# Altium schematic sheet Semikron_BrakeChopper.SchDoc
size A; SheetNumber: 2; SheetTotal: 6
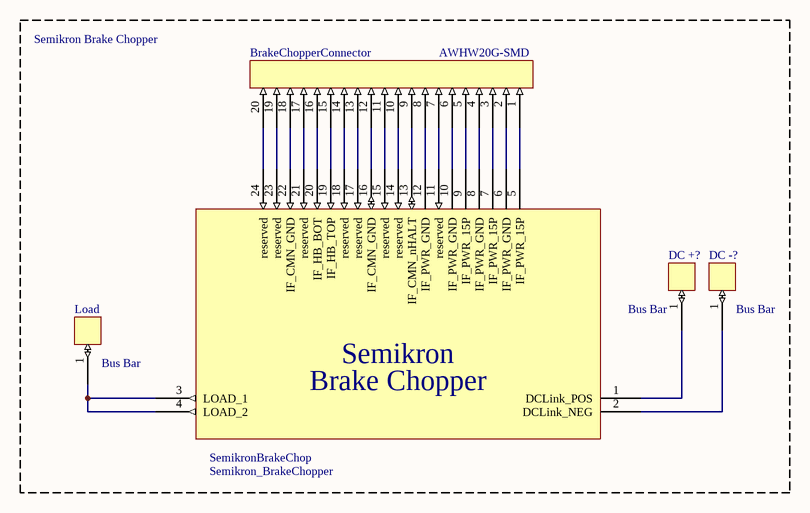
[diagram p0: Semikron_BrakeChopper.SchDoc]

## Parts
BrakeChopperConnector  AWHW20G-SMD
DC_+?  Bus Bar
DC_-?  Bus Bar
Load  Bus Bar
SemikronBrakeChop  Semikron_BrakeChopper

## Blocks framed on the sheet
Semikron Brake Chopper: BrakeChopperConnector DC_+? DC_-? Load SemikronBrakeChop

## Nets
NetBrakeChopperConnector_1: BrakeChopperConnector.1 SemikronBrakeChop.5(IF_PWR_15P)
NetBrakeChopperConnector_2: BrakeChopperConnector.2 SemikronBrakeChop.6(IF_PWR_GND)
NetBrakeChopperConnector_3: BrakeChopperConnector.3 SemikronBrakeChop.7(IF_PWR_15P)
NetBrakeChopperConnector_4: BrakeChopperConnector.4 SemikronBrakeChop.8(IF_PWR_GND)
NetBrakeChopperConnector_5: BrakeChopperConnector.5 SemikronBrakeChop.9(IF_PWR_15P)
NetBrakeChopperConnector_6: BrakeChopperConnector.6 SemikronBrakeChop.10(IF_PWR_GND)
NetBrakeChopperConnector_7: BrakeChopperConnector.7 SemikronBrakeChop.11(reserved)
NetBrakeChopperConnector_8: BrakeChopperConnector.8 SemikronBrakeChop.12(IF_PWR_GND)
NetBrakeChopperConnector_9: BrakeChopperConnector.9 SemikronBrakeChop.13(IF_CMN_nHALT)
NetBrakeChopperConnector_10: BrakeChopperConnector.10 SemikronBrakeChop.14(reserved)
NetBrakeChopperConnector_11: BrakeChopperConnector.11 SemikronBrakeChop.15(reserved)
NetBrakeChopperConnector_12: BrakeChopperConnector.12 SemikronBrakeChop.16(IF_CMN_GND)
NetBrakeChopperConnector_13: BrakeChopperConnector.13 SemikronBrakeChop.17(reserved)
NetBrakeChopperConnector_14: BrakeChopperConnector.14 SemikronBrakeChop.18(reserved)
NetBrakeChopperConnector_15: BrakeChopperConnector.15 SemikronBrakeChop.19(IF_HB_TOP)
NetBrakeChopperConnector_16: BrakeChopperConnector.16 SemikronBrakeChop.20(IF_HB_BOT)
NetBrakeChopperConnector_17: BrakeChopperConnector.17 SemikronBrakeChop.21(reserved)
NetBrakeChopperConnector_18: BrakeChopperConnector.18 SemikronBrakeChop.22(IF_CMN_GND)
NetBrakeChopperConnector_19: BrakeChopperConnector.19 SemikronBrakeChop.23(reserved)
NetBrakeChopperConnector_20: BrakeChopperConnector.20 SemikronBrakeChop.24(reserved)
NetDC_+?_1: DC_+?.1 SemikronBrakeChop.1(DCLink_POS)
NetDC_-?_1: DC_-?.1 SemikronBrakeChop.2(DCLink_NEG)
NetLoad_1: Load.1 SemikronBrakeChop.3(LOAD_1) SemikronBrakeChop.4(LOAD_2)

## Notes on the sheet
- (in symbol CMP-001-0002-3) Semikron; Brake Chopper

## Library data of the parts
BrakeChopperConnector = CMP-002-00075-1: ASSMANN WSW AWHW Series, 2.54mm Pitch 20 Way 2 Row Straight PCB Header, Solder Termination, 3A
DC_+? DC_-? Load = CMP-001-0000-1: Single Connection bus bar
SemikronBrakeChop = CMP-001-0002-3: Integrated buck device w/ heatsink